# Altium schematic sheet InclinometerDisplay.SchDoc
size 420 x 297 mm; Address1: Address1; Address2: Address2; Address3: Address3; Address4: Address4; DocumentNumber: АБВГ.123456.001 Э3; SheetNumber: 1; Scale: 1:1; DocumentType: Схема электрическая принципиальная; FirstReferrence: АБВГ.123456.001
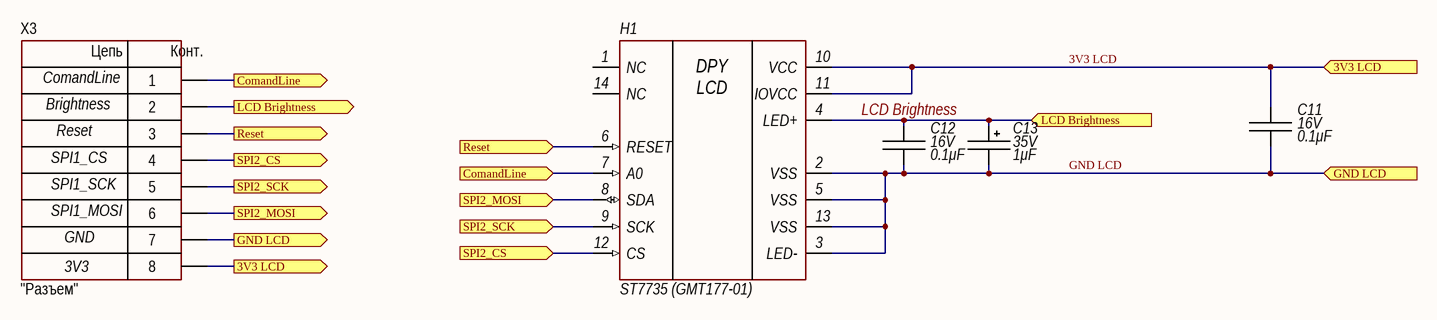
[diagram p0: InclinometerDisplay.SchDoc]

## Parts
C11  value 0.1μF  Voltage: 16V  [CAP: 0603]
C12  value 0.1μF  Voltage: 16V  [CAP: 0603]
C13  value 1μF  Voltage: 35V  [CAP: TANTAL-A]
H1  ST7735 (GMT177-01)  [ST7735 DISPLAY]
X3  CommentText: "Разъем"  [CON: PLS-8]

## Ports
3V3 LCD (in), 3V3 LCD (out), ComandLine (in), ComandLine (out), GND LCD (in), GND LCD (out), LCD Brightness (in), LCD Brightness (out), Reset (in), Reset (out), SPI2_CS (in), SPI2_CS (out), SPI2_MOSI (in), SPI2_MOSI (out), SPI2_SCK (in), SPI2_SCK (out)

## Nets
3V3 LCD: C11.2 H1.10(VCC) H1.11(IOVCC) X3.8 ; port 3V3 LCD
ComandLine: H1.7(A0) X3.1 ; port ComandLine
GND LCD: C11.1 C12.1 C13.2 H1.2(VSS) H1.3(LED-) H1.5(VSS) H1.13(VSS) X3.7 ; port GND LCD
LCD Brightness: C12.2 C13.1 H1.4(LED+) X3.2 ; port LCD Brightness
Reset: H1.6(RESET) X3.3 ; port Reset
SPI2_CS: H1.12(CS) X3.4 ; port SPI2_CS
SPI2_MOSI: H1.8(SDA) X3.6 ; port SPI2_MOSI
SPI2_SCK: H1.9(SCK) X3.5 ; port SPI2_SCK

Not connected (* = marked no-connect by the designer): H1 1(NC) 14(NC)

## Notes on the sheet
- (near X3) ComandLine
- (near X3) Brightness
- SPI1_CS
- SPI1_SCK
- Reset
- (near X3) SPI1_MOSI
- GND
- 3V3
- Перв. примен.
- Справ. №
- Подп. и дата
- Инв. № дубл.
- Взам. инв. №
- Разраб.
- Изм.
- Лист
- № докум.
- Подп.
- Дата
- Лит.
- Масса
- Масштаб
- Пров.
- Т.контр.
- Листов
- Инв. № подл.
- Утв.
- Н.контр.
- 2.106-A3
- Копировал
- Формат А3
- (in symbol PLS-8) Цепь; Конт.
- (in symbol ST7735 DISPLAY) DPY / LCD

## Library data of the parts
C11 C12 = Ceramic_0603: Manufacturer: Murata Electronics; PartNumber: GRM188R71C104KA01D; ValueManufacturerPartNumber: Ceramic capacitor, 0.1μF, X7R, ±10%, 16V, 0603, -55...+125°C; TypeCapacitor: Ceramic capacitor; Tolerance: ±10%; TypeDielectric: X7R; Package: 0603; HelpURL: https://www.digikey.com/product-detail/en/murata-electronics/GRM188R71C104KA01D/490-1532-2-ND/587060; Temperature: -55...+125°C
C13 = Tantal_A: Manufacturer: AVX; PartNumber: TAJA105K035RNJ; ValueManufacturerPartNumber: Tantalum capacitor, 1μF, 35V, ±10%, 7.5Ohm, case A (3216), -55...+125°C; Impedance: 7.5Ohm; Tolerance: ±10%; TypeCapacitor: Tantalum capacitor; Package: case A (3216); HelpURL: https://www.digikey.com/product-detail/en/avx-corporation/TAJA105K035RNJ/478-1651-2-ND/563759; Temperature: -55...+125°C
H1 = ST7735 DISPLAY: Manufacture: Sitronix; Model: ST7735 (GMT177-01); Help URL: https://pdf1.alldatasheetru.com/datasheet-pdf/view/326213/SITRONIX/ST7735.html
X3 = PLS-8: Manufacturer: Connfly; ValueManufacturerPartNumber: Connector, 8pin, 2.54mm, 500VAC, 3A; TypeConnector: Connector; VoltageMax: 500VAC; Pitch: 2.54mm; CurrentMax: 3A; Multichannel: 8pin; HelpURL: https://www.chipdip.ru/product/pls-8-ds1021-1-8sf112; PartNumber: PLS-8